# Altium schematic sheet First_Sheet.SCHDOC
size 297 x 209 mm
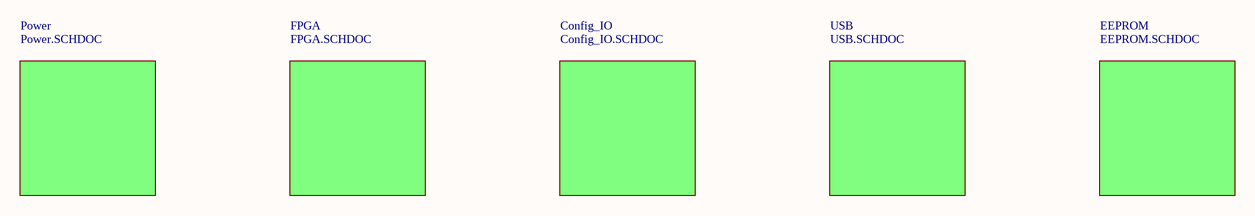
[diagram p0: First_Sheet.SCHDOC]

## Sub-sheets
Config_IO = Config_IO.SCHDOC: no entries
EEPROM = EEPROM.SCHDOC: no entries
FPGA = FPGA.SCHDOC: no entries
Power = Power.SCHDOC: no entries
USB = USB.SCHDOC: no entries